# EAGLE schematic NT0X67AA (EAGLE 6.6.0)
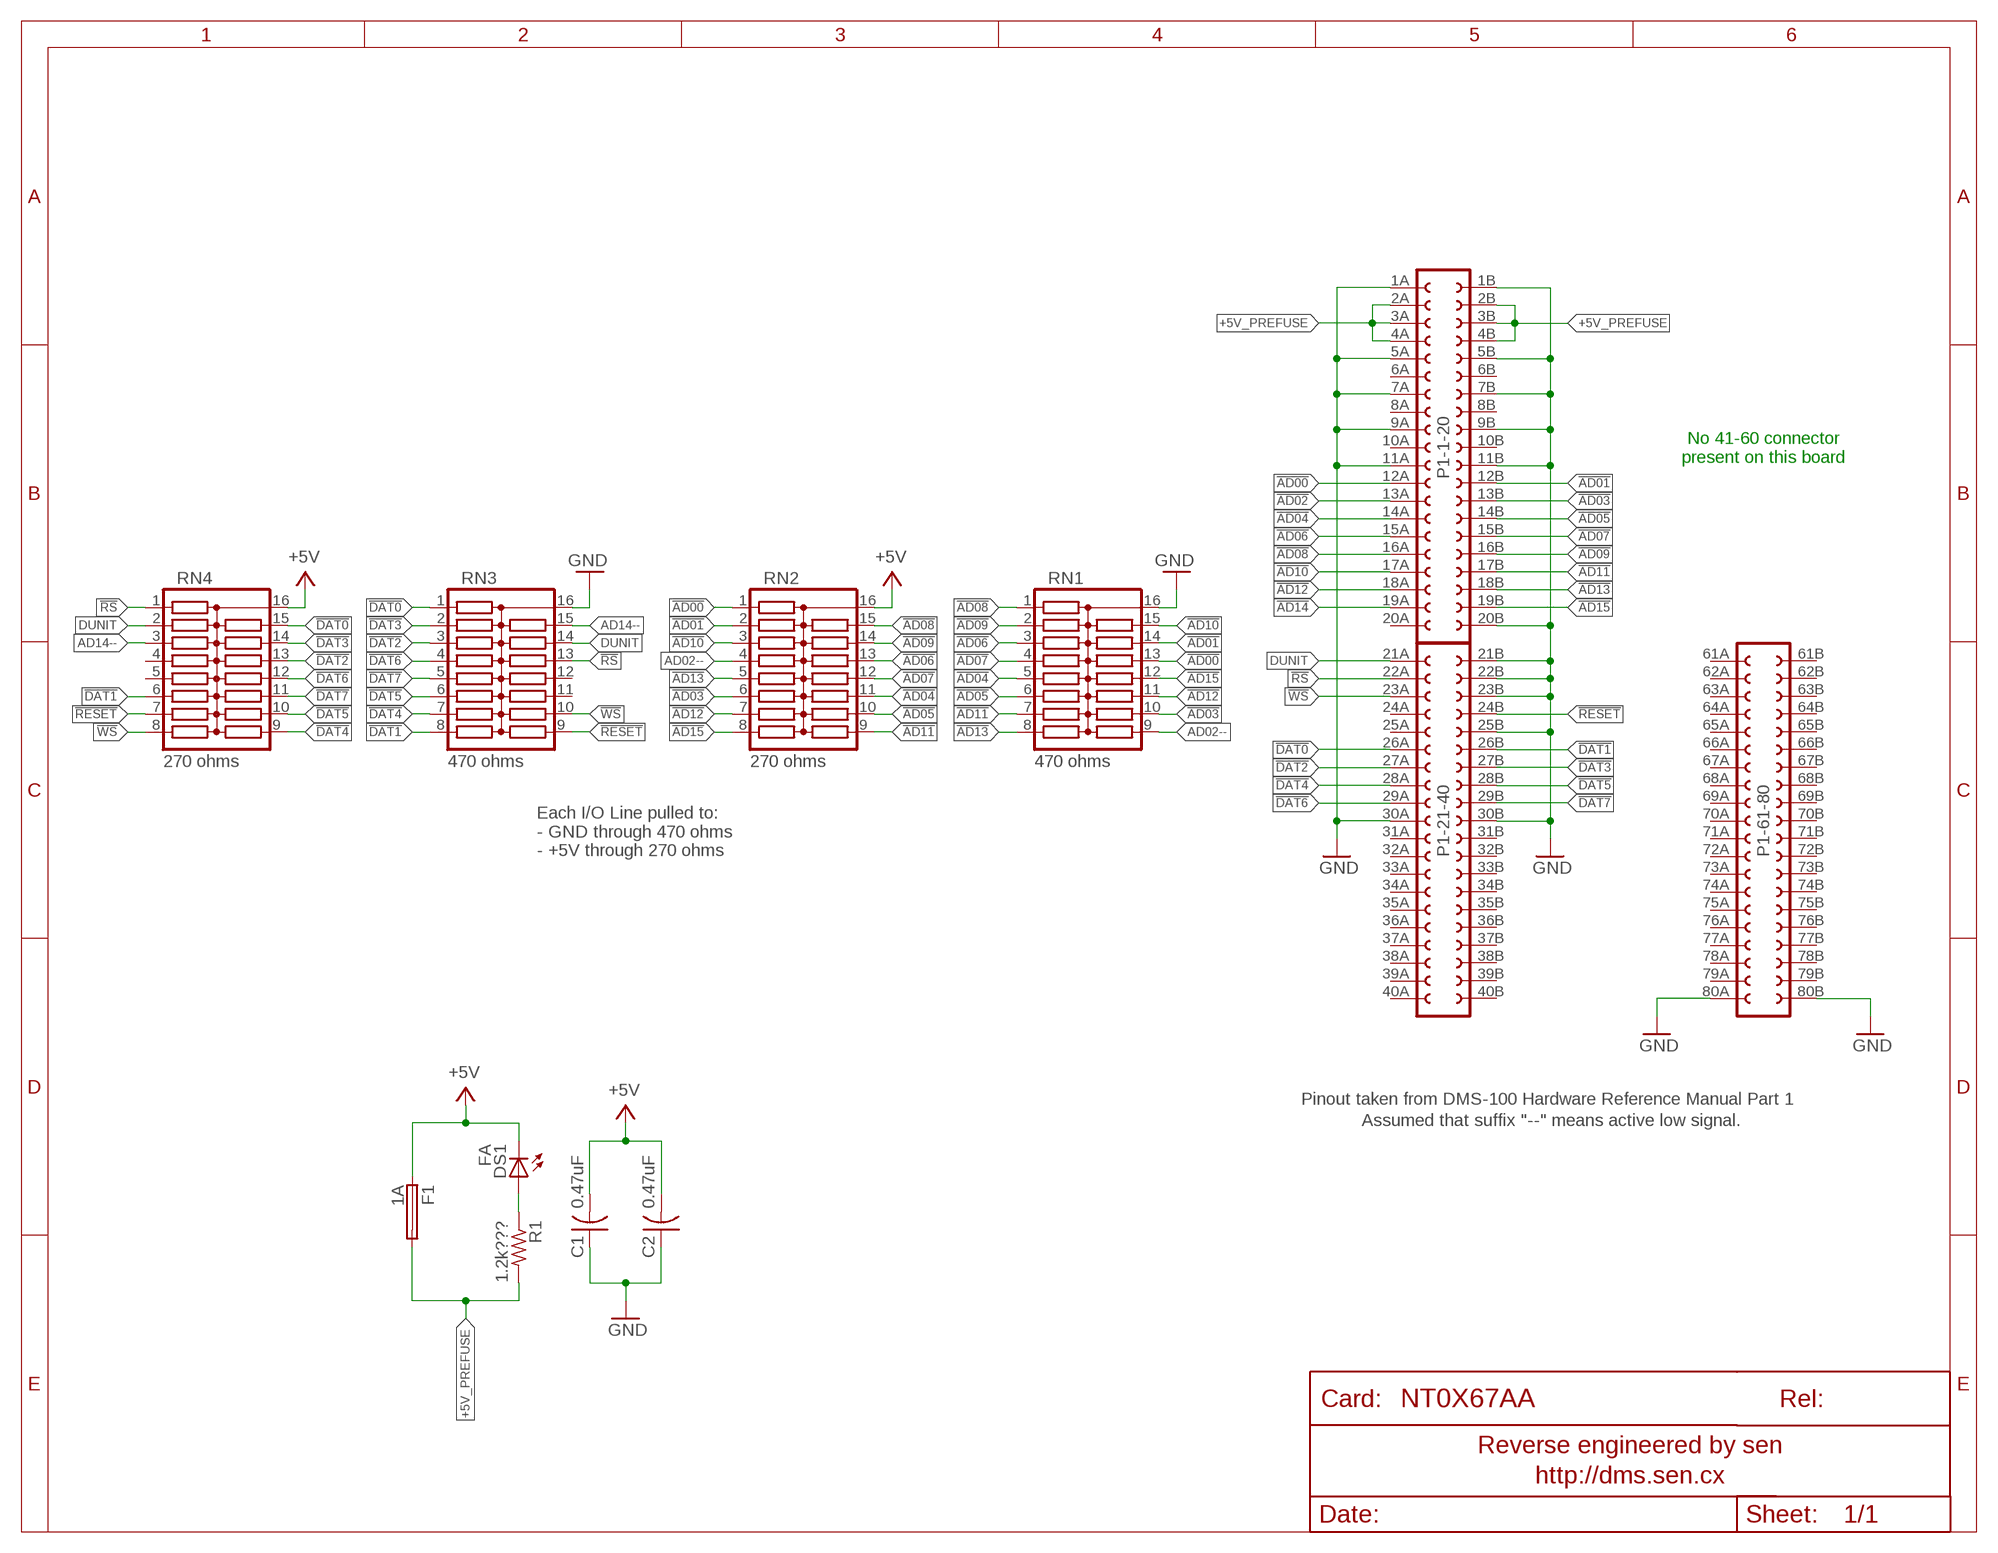
[diagram p0: schematic, sheet 1]
FRAME1 (FRAME-LETTER-GRID-DMS): REL: 04

## Parts
C1  0.47uF  C-US150-054X183  [C150-054X183]
C2  0.47uF  C-US150-054X183  [C150-054X183]
DS1  FA  LED5MM  [LED5MM]
F1  1A  FUSEPICOFUSE  [PICOFUSE]
P1  FE80-2W-HALFKEY  [FE80-2W-HALFKEY]
R1  1.2k???  R-US_0207/15  [0207/15]
RN1  470 ohms  15R  [DIL16]
RN2  270 ohms  15R  [DIL16]
RN3  470 ohms  15R  [DIL16]
RN4  270 ohms  15R  [DIL16]

## Nets
!AD00: P1.12A(-1-20:12A) RN1.13 RN2.1
!AD01: P1.12B(-1-20:12B) RN1.14 RN2.2
!AD02: P1.13A(-1-20:13A)
!AD03: P1.13B(-1-20:13B) RN1.10 RN2.6
!AD04: P1.14A(-1-20:14A) RN1.5 RN2.11
!AD05: P1.14B(-1-20:14B) RN1.6 RN2.10
!AD06: P1.15A(-1-20:15A) RN1.3 RN2.13
!AD07: P1.15B(-1-20:15B) RN1.4 RN2.12
!AD08: P1.16A(-1-20:16A) RN1.1 RN2.15
!AD09: P1.16B(-1-20:16B) RN1.2 RN2.14
!AD10: P1.17A(-1-20:17A) RN1.15 RN2.3
!AD11: P1.17B(-1-20:17B) RN1.7 RN2.9
!AD12: P1.18A(-1-20:18A) RN1.11 RN2.7
!AD13: P1.18B(-1-20:18B) RN1.8 RN2.5
!AD14: P1.19A(-1-20:19A)
!AD15: P1.19B(-1-20:19B) RN1.12 RN2.8
!DAT0: P1.26A(-21-40:6A) RN3.1 RN4.15
!DAT1: P1.26B(-21-40:6B) RN3.8 RN4.6
!DAT2: P1.27A(-21-40:7A) RN3.3 RN4.13
!DAT3: P1.27B(-21-40:7B) RN3.2 RN4.14
!DAT4: P1.28A(-21-40:8A) RN3.7 RN4.9
!DAT5: P1.28B(-21-40:8B) RN3.6 RN4.10
!DAT6: P1.29A(-21-40:9A) RN3.4 RN4.12
!DAT7: P1.29B(-21-40:9B) RN3.5 RN4.11
!RESET: P1.24B(-21-40:4B) RN3.9 RN4.7
!RS: P1.22A(-21-40:2A) RN3.13 RN4.1
!WS: P1.23A(-21-40:3A) RN3.10 RN4.8
+5V: C1.2 C2.2 DS1.K(C) F1.1 RN2.16 RN4.16
+5V_PREFUSE: F1.2 P1.2A(-1-20:2A) P1.2B(-1-20:2B) P1.3A(-1-20:3A) P1.3B(-1-20:3B) P1.4A(-1-20:4A) P1.4B(-1-20:4B) R1.2
AD02--: RN1.9 RN2.4
AD14--: RN3.15 RN4.3
DS1-R: DS1.A R1.1
DUNIT: P1.21A(-21-40:1A) RN3.14 RN4.2
GND: C1.1 C2.1 P1.1A(-1-20:1A) P1.1B(-1-20:1B) P1.5A(-1-20:5A) P1.5B(-1-20:5B) P1.7A(-1-20:7A) P1.7B(-1-20:7B) P1.9A(-1-20:9A) P1.9B(-1-20:9B) P1.11A(-1-20:11A) P1.11B(-1-20:11B) P1.20B(-1-20:20B) P1.21B(-21-40:1B) P1.22B(-21-40:2B) P1.23B(-21-40:3B) P1.25B(-21-40:5B) P1.30A(-21-40:10A) P1.30B(-21-40:10B) P1.80A(-61-80:20A) P1.80B(-61-80:20B) RN1.16 RN3.16
Unconnected: P1.6A(-1-20:6A) P1.6B(-1-20:6B) P1.8A(-1-20:8A) P1.8B(-1-20:8B) P1.10A(-1-20:10A) P1.10B(-1-20:10B) P1.20A(-1-20:20A) P1.24A(-21-40:4A) P1.25A(-21-40:5A) P1.31A(-21-40:11A) P1.31B(-21-40:11B) P1.32A(-21-40:12A) P1.32B(-21-40:12B) P1.33A(-21-40:13A) P1.33B(-21-40:13B) P1.34A(-21-40:14A) P1.34B(-21-40:14B) P1.35A(-21-40:15A) P1.35B(-21-40:15B) P1.36A(-21-40:16A) P1.36B(-21-40:16B) P1.37A(-21-40:17A) P1.37B(-21-40:17B) P1.38A(-21-40:18A) P1.38B(-21-40:18B) P1.39A(-21-40:19A) P1.39B(-21-40:19B) P1.40A(-21-40:20A) P1.40B(-21-40:20B) P1.41A(-41-60:1A) P1.41B(-41-60:1B) P1.42A(-41-60:2A) P1.42B(-41-60:2B) P1.43A(-41-60:3A) P1.43B(-41-60:3B) P1.44A(-41-60:4A) P1.44B(-41-60:4B) P1.45A(-41-60:5A) P1.45B(-41-60:5B) P1.46A(-41-60:6A) P1.46B(-41-60:6B) P1.47A(-41-60:7A) P1.47B(-41-60:7B) P1.48A(-41-60:8A) P1.48B(-41-60:8B) P1.49A(-41-60:9A) P1.49B(-41-60:9B) P1.50A(-41-60:10A) P1.50B(-41-60:10B) P1.51A(-41-60:11A) P1.51B(-41-60:11B) P1.52A(-41-60:12A) P1.52B(-41-60:12B) P1.53A(-41-60:13A) P1.53B(-41-60:13B) P1.54A(-41-60:14A) P1.54B(-41-60:14B) P1.55A(-41-60:15A) P1.55B(-41-60:15B) P1.56A(-41-60:16A) P1.56B(-41-60:16B) P1.57A(-41-60:17A) P1.57B(-41-60:17B) P1.58A(-41-60:18A) P1.58B(-41-60:18B) P1.59A(-41-60:19A) P1.59B(-41-60:19B) P1.60A(-41-60:20A) P1.60B(-41-60:20B) P1.61A(-61-80:1A) P1.61B(-61-80:1B) P1.62A(-61-80:2A) P1.62B(-61-80:2B) P1.63A(-61-80:3A) P1.63B(-61-80:3B) P1.64A(-61-80:4A) P1.64B(-61-80:4B) P1.65A(-61-80:5A) P1.65B(-61-80:5B) P1.66A(-61-80:6A) P1.66B(-61-80:6B) P1.67A(-61-80:7A) P1.67B(-61-80:7B) P1.68A(-61-80:8A) P1.68B(-61-80:8B) P1.69A(-61-80:9A) P1.69B(-61-80:9B) P1.70A(-61-80:10A) P1.70B(-61-80:10B) P1.71A(-61-80:11A) P1.71B(-61-80:11B) P1.72A(-61-80:12A) P1.72B(-61-80:12B) P1.73A(-61-80:13A) P1.73B(-61-80:13B) P1.74A(-61-80:14A) P1.74B(-61-80:14B) P1.75A(-61-80:15A) P1.75B(-61-80:15B) P1.76A(-61-80:16A) P1.76B(-61-80:16B) P1.77A(-61-80:17A) P1.77B(-61-80:17B) P1.78A(-61-80:18A) P1.78B(-61-80:18B) P1.79A(-61-80:19A) P1.79B(-61-80:19B) RN3.11 RN3.12 RN4.4 RN4.5

## Notes on the sheet
- No 41-60 connector
  present on this board
- Each I/O Line pulled to:
  - GND through 470 ohms
  - +5V through 270 ohms
- Pinout taken from DMS-100 Hardware Reference Manual Part 1
- Assumed that suffix "--" means active low signal.

## Library data of the parts
C1 C2 = rcl:C-US: CAPACITOR, American symbol
DS1 = led:LED: LED OSRAM: - CHIPLED LG R971, LG N971, LY N971, LG Q971, LY Q971, LO R971, LY R971 LH N974, LH R974 LS Q976, LO Q976, LY Q976 LO Q996 - Hyper CHIPLED LW Q18S LB Q993, LB Q99A, LB R99A - SideLED LS A670, LO A670, LY A670, LG A670, LP A670 LB A673, LV A673, LT A673, LW A673 LH A674 LY A675 LS A676, LA A676, LO A676, LY A676, LW A676 LS A679, LY A679, LG A679 - Hyper Micro SIDELED® LS Y876, LA Y876, LO Y876, LY Y876 LT Y87S - SmartLED LW L88C, LW L88S LB L89C, LB L89S, LG L890 LS L89K, LO L89K, LY L89K LS L896, LA L896, LO L896, LY L896 - TOPLED LS T670, LO T670, LY T670, LG T670, LP T670 LSG T670, LSP T670, LSY T670, LOP T670, LYG T670 LG T671, LOG T671, LSG T671 LB T673, LV T673, LT T673, LW T673 LH T674 LS T676, LA T676, LO T676, LY T676, LB T676, LH T676, LSB T676, LW T676 LB T67C, LV T67C, LT T67C, LS T67K, LO T67K, LY T67K, LW E67C LS E67B, LA E67B, LO E67B, LY E67B, LB E67C, LV E67C, LT E67C LW T67C LS T679, LY T679, LG T679 LS T770, LO T770, LY T770, LG T770, LP T770 LB T773, LV T773, LT T773, LW T773 LH T774 LS E675, LA E675, LY E675, LS T675 LS T776, LA T776, LO T776, LY T776, LB T776 LHGB T686 LT T68C, LB T68C - Hyper Mini TOPLED® LB M676 - Mini TOPLED Santana® LG M470 LS M47K, LO M47K, LY M47K Source: http://www.osram.convergy.de LUXEON: - LUMILED® LXK2-PW12-R00, LXK2-PW12-S00, LXK2-PW14-U00, LXK2-PW14-V00 LXK2-PM12-R00, LXK2-PM12-S00, LXK2-PM14-U00 LXK2-PE12-Q00, LXK2-PE12-R00, LXK2-PE12-S00, LXK2-PE14-T00, LXK2-PE14-U00 LXK2-PB12-K00, LXK2-PB12-L00, LXK2-PB12-M00, LXK2-PB14-N00, LXK2-PB14-P00, LXK2-PB14-Q00 LXK2-PR12-L00, LXK2-PR12-M00, LXK2-PR14-Q00, LXK2-PR14-R00 LXK2-PD12-Q00, LXK2-PD12-R00, LXK2-PD12-S00 LXK2-PH12-R00, LXK2-PH12-S00 LXK2-PL12-P00, LXK2-PL12-Q00, LXK2-PL12-R00 Source: www.luxeon.com KINGBRIGHT: KA-3528ASYC Source: www.kingbright.com
F1 = fuse:FUSE: Fuse; OC_FARNELL: unknown; OC_NEWARK: unknown
P1 = dms-connector:FE80-2W-HALFKEY: FEMALE HEADER Used for backplane on IOC Shelf, 2 40x2 segments with a key between.; OC_FARNELL: unknown; OC_NEWARK: unknown
R1 = rcl:R-US_: RESISTOR, American symbol
RN1-RN4 = resistor-dil:15R: DIL RESISTOR; OC_FARNELL: unknown; OC_NEWARK: unknown